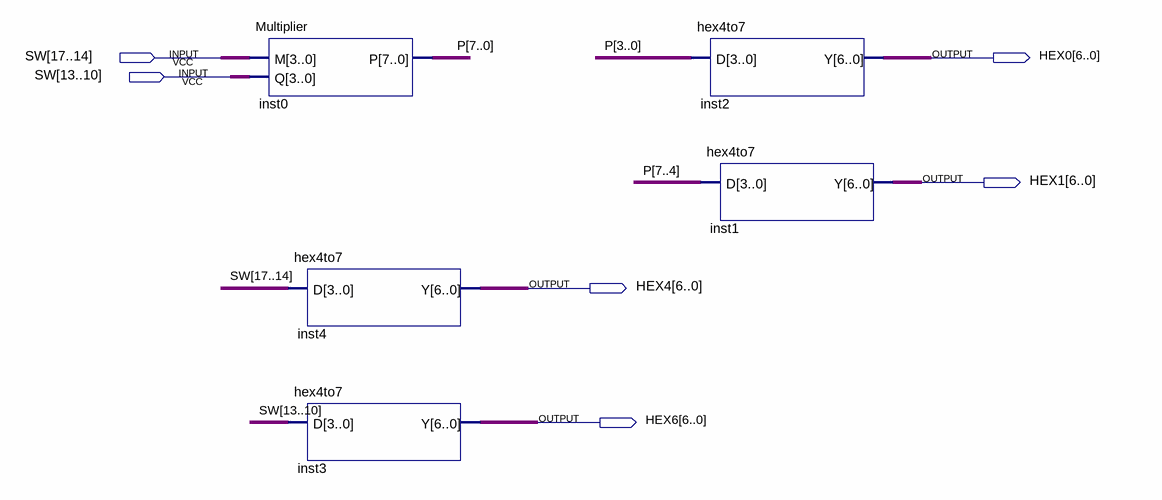
[diagram p0: schematic sheet]
// Quartus schematic lab7.bdf as structural Verilog: 5 symbols, 6 pins
module lab7 (
  input  [17:10] SW,
  output [6:0] HEX0,
  output [6:0] HEX1,
  output [6:0] HEX4,
  output [6:0] HEX6
);

  wire [7:0] P;

  Multiplier inst0 (.M(SW[17:14]), .Q(SW[13:10]), .P(P));
  hex4to7 inst4 (.D(SW[17:14]), .Y(HEX4));
  hex4to7 inst3 (.D(SW[13:10]), .Y(HEX6));
  hex4to7 inst2 (.D(P[3:0]), .Y(HEX0));
  hex4to7 inst1 (.D(P[7:4]), .Y(HEX1));
endmodule
